# Altium project Slave_Project.PrjPcb
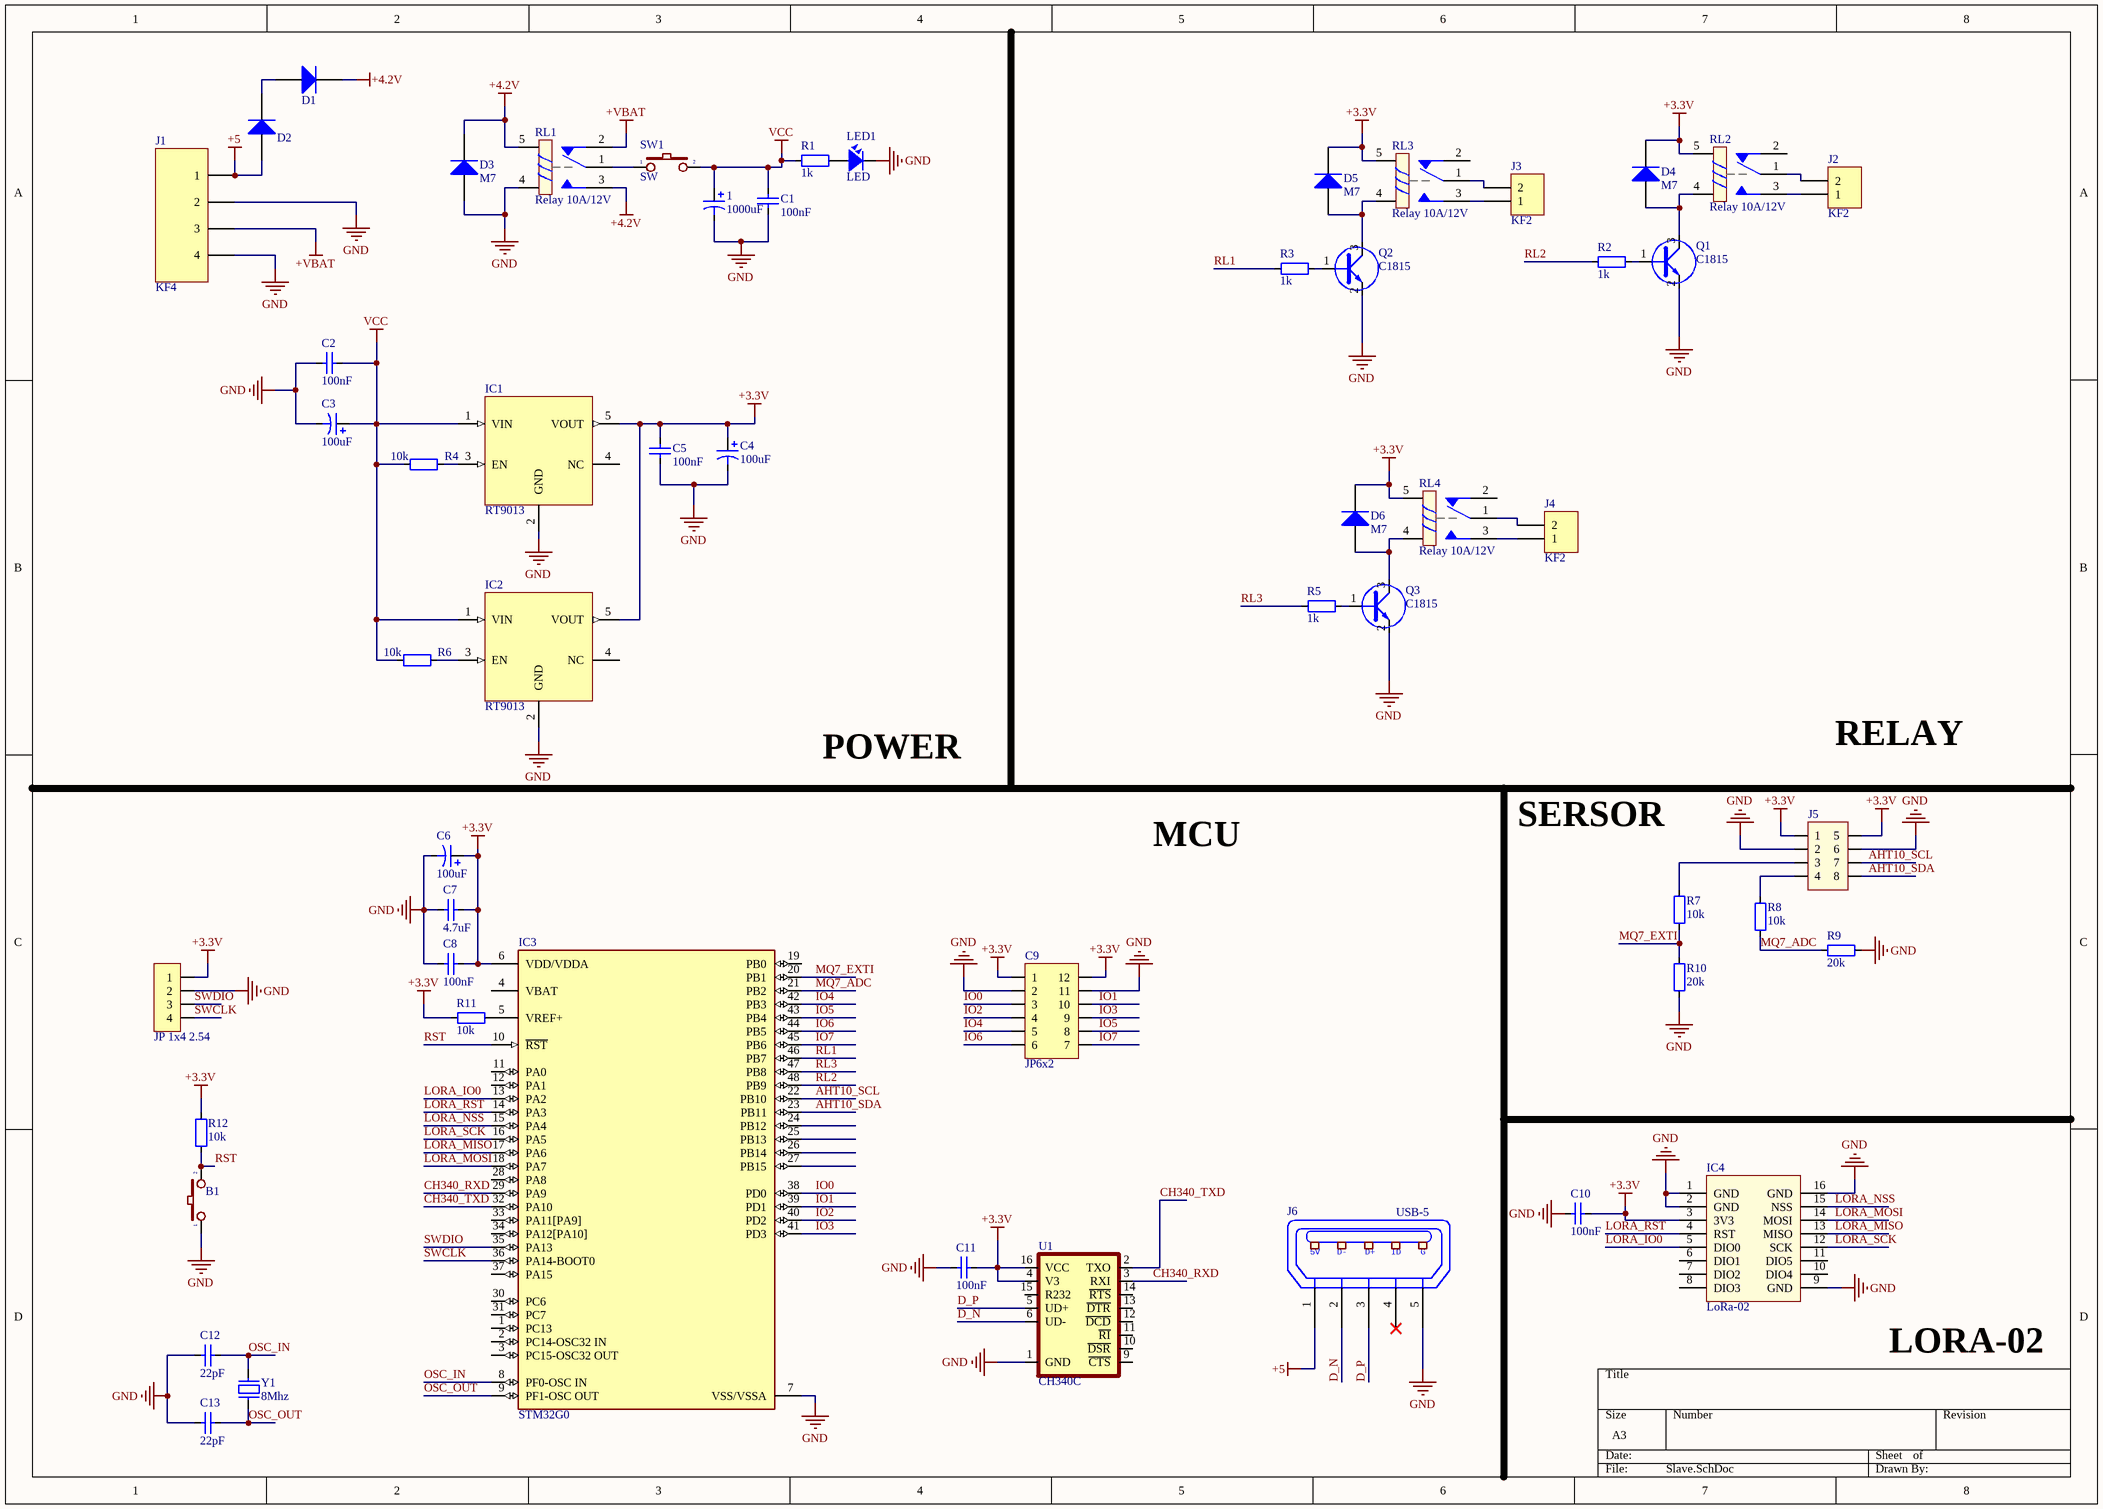
[diagram p0: Slave.SchDoc]
1 sheet, 55 parts. Net scope: global (net labels, ports and power ports of the same name join across sheets).
Board file: Slave.PcbDoc

## Sheet Slave.SchDoc
size A3; SheetNumber: 1; SheetTotal: 1

### Parts
1  1000uF  [C8mm]
B1  Button 3x4x2.5  [Button 3x4x2.5]  (value not drawn)
C1  100nF  [CAP_0805]
C2  100nF  [CAP_0805]
C3  100uF  [C5mm]
C4  100uF  [C5mm]
C5  100nF  [CAP_0805]
C6  100uF  [C5mm]
C7  4.7uF  [CAP_0805]
C8  100nF  [CAP_0805]
C9  JP6x2  [JP6-D2T]
C10  100nF  [CAP_0805]
C11  100nF  [CAP_0805]
C12  22pF  [CAP_0805]
C13  22pF  [CAP_0805]
D1  SS34 Diode 3A 40V  [DIODE SMA]  (value not drawn)
D2  SS34 Diode 3A 40V  [DIODE SMA]  (value not drawn)
D3  M7  [DIODE SMA]
D4  M7  [DIODE SMA]
D5  M7  [DIODE SMA]
D6  M7  [DIODE SMA]
IC1  RT9013  [SOT23-5]
IC2  RT9013  [SOT23-5]
IC3  STM32G0  [STM32G0]
IC4  LoRa-02  [LoRa-02]
J1  KF4  [KF4-5.08]
J2  KF2  [KF2-3.5]
J3  KF2  [KF2-3.5]
J4  KF2  [KF2-3.5]
J5  Connector 4x2  [JP4x2]  (value not drawn)
J6  USB-5  [USB-M1]
JP1  JP 1x4 2.54  [JP 1x4 DT]
LED1  LED  [LED-0805-Red]
Q1  C1815  [SOT23D]
Q2  C1815  [SOT23D]
Q3  C1815  [SOT23D]
R1  1k  [RES-SMD-0805]
R2  1k  [RES-SMD-0805]
R3  1k  [RES-SMD-0805]
R4  10k  [RES-SMD-0805]
R5  1k  [RES-SMD-0805]
R6  10k  [RES-SMD-0805]
R7  10k  [RES-SMD-0805]
R8  10k  [RES-SMD-0805]
R9  20k  [RES-SMD-0805]
R10  20k  [RES-SMD-0805]
R11  10k  [RES-SMD-0805]
R12  10k  [RES-SMD-0805]
RL1  Relay 10A/12V  [RELAY 5]
RL2  Relay 10A/12V  [RELAY 5]
RL3  Relay 10A/12V  [RELAY 5]
RL4  Relay 10A/12V  [RELAY 5]
SW1  SW  [SW2]
U1  CH340C  [SO016]
Y1  8Mhz  [Thach Anh 2 chan SMD5032]

### Nets
+3.3V: C4.1 C5.1 C6.1 C7.2 C8.1 C9.1 C9.12 C10.2 C11.2 D4.2(K) D5.2(K) D6.2(K) IC1.5(VOUT) IC2.5(VOUT) IC3.6(VDD/VDDA) IC4.3(3V3) J5.1 J5.5 JP1.1 R11.1 R12.1 RL2.5 RL3.5 RL4.5 U1.4(V3) U1.16(VCC)
+4.2V: D1.2(K) D3.2(K) RL1.3 RL1.5
+5: D2.1(A) J1.1 J6.1(P1)
+VBAT: J1.3 RL1.2
GND: 1.2 B1.1 C1.2 C2.2 C3.2 C4.2 C5.2 C6.2 C7.1 C8.2 C9.2 C9.11 C10.1 C11.1 C12.2 C13.2 D3.1(A) IC1.2(GND) IC2.2(GND) IC3.7(VSS/VSSA) IC4.1(GND) IC4.2(GND) IC4.9(GND) IC4.16(GND) J1.2 J1.4 J5.2 J5.6 J6.5(P5) JP1.2 LED1.2 Q1.2(E) Q2.2(E) Q3.2(E) R9.1 R10.1 RL1.4 U1.1(GND)
VCC: 1.1 C1.1 C2.1 C3.1 IC1.1(VIN) IC2.1(VIN) R1.2 R4.2 R6.2 SW1.2
AHT10_SCL: IC3.22(PB10) J5.7
AHT10_SDA: IC3.23(PB11) J5.8
CH340_RXD: IC3.29(PA9) U1.3(RXI)
CH340_TXD: IC3.32(PA10) U1.2(TXO)
D_N: J6.2(P2) U1.6(UD-)
D_P: J6.3(P3) U1.5(UD+)
IO0: C9.3 IC3.38(PD0)
IO1: C9.10 IC3.39(PD1)
IO2: C9.4 IC3.40(PD2)
IO3: C9.9 IC3.41(PD3)
IO4: C9.5 IC3.42(PB3)
IO5: C9.8 IC3.43(PB4)
IO6: C9.6 IC3.44(PB5)
IO7: C9.7 IC3.45(PB6)
LORA_IO0: IC3.13(PA2) IC4.5(DIO0)
LORA_MISO: IC3.17(PA6) IC4.13(MISO)
LORA_MOSI: IC3.18(PA7) IC4.14(MOSI)
LORA_NSS: IC3.15(PA4) IC4.15(NSS)
LORA_RST: IC3.14(PA3) IC4.4(RST)
LORA_SCK: IC3.16(PA5) IC4.12(SCK)
MQ7_ADC: IC3.21(PB2) R8.1 R9.2
MQ7_EXTI: IC3.20(PB1) R7.1 R10.2
OSC_IN: C12.1 IC3.8(PF0-OSC_IN) Y1.2
OSC_OUT: C13.1 IC3.9(PF1-OSC_OUT) Y1.1
RL1: IC3.46(PB7) R3.1
RL2: IC3.48(PB9) R2.1
RL3: IC3.47(PB8) R5.1
RST: B1.2 IC3.10(~{RST}) R12.2
SWCLK: IC3.36(PA14-BOOT0) JP1.4
SWDIO: IC3.35(PA13) JP1.3
NetD1_1: D1.1(A) D2.2(K)
NetD4_1: D4.1(A) Q1.3(C) RL2.4
NetD5_1: D5.1(A) Q2.3(C) RL3.4
NetD6_1: D6.1(A) Q3.3(C) RL4.4
NetIC1_3: IC1.3(EN) R4.1
NetIC2_3: IC2.3(EN) R6.1
NetIC3_5: IC3.5(VREF+) R11.2
NetJ2_1: J2.1 RL2.3
NetJ2_2: J2.2 RL2.1
NetJ3_1: J3.1 RL3.3
NetJ3_2: J3.2 RL3.1
NetJ4_1: J4.1 RL4.3
NetJ4_2: J4.2 RL4.1
NetJ5_3: J5.3 R7.2
NetJ5_4: J5.4 R8.2
NetLED1_1: LED1.1 R1.1
NetQ1_1: Q1.1(B) R2.2
NetQ2_1: Q2.1(B) R3.2
NetQ3_1: Q3.1(B) R5.2
NetRL1_1: RL1.1 SW1.1

Not connected (* = marked no-connect by the designer): IC1 4(NC); IC2 4(NC); IC3 1(PC13) 2(PC14-OSC32_IN) 3(PC15-OSC32_OUT) 4(VBAT) 11(PA0) 12(PA1) 19(PB0) 24(PB12) 25(PB13) 26(PB14) 27(PB15) 28(PA8) 30(PC6) 31(PC7) 33(PA11[PA9]) 34(PA12[PA10]) 37(PA15); IC4 6(DIO1) 7(DIO2) 8(DIO3) 10(DIO4) 11(DIO5); J6 4(P4)*; RL2 2; RL3 2; RL4 2; U1 9(~{CTS}) 10(~{DSR}) 11(~{RI}) 12(~{DCD}) 13(~{DTR}) 14(~{RTS}) 15(R232)

### Notes on the sheet
- POWER
- RELAY
- MCU
- SERSOR
- LORA-02
- (in symbol USB-5) 5V; D-; D+; ID; G

### Library data of the parts
1 = Cap Pol: 1000uF 16V 8x16mm; Published: 8-Jun-2000; LatestRevisionDate: 17-Jul-2002; LatestRevisionNote: Re-released for DXP Platform.; PackageReference: POLAR0.8; Publisher: Altium Limited
C1 C2 C5 C7 C8 C10-C13 = CapSMD: Capacitor; Value: 33p; Published: 8-Jun-2000; LatestRevisionDate: 17-Jul-2002; LatestRevisionNote: Re-released for DXP Platform.; PackageReference: RAD-0.3; Publisher: Altium Limited
C3 C4 C6 = Cap Pol: 100uF 16V; Published: 8-Jun-2000; LatestRevisionDate: 17-Jul-2002; LatestRevisionNote: Re-released for DXP Platform.; PackageReference: POLAR0.8; Publisher: Altium Limited
C9 = JP6x2: WR-PHD 2.54 mm Dual Socket Header; Manufacturer: W¨¹rth Elektronik eiSos GmbH; partNo: 61301221821; ComponentLink1 Description: Manufacturer; ComponentLink2 Description: Datasheet; NoPins: 12; Created Date: 29 March 2013; ComponentLink1URL: http://www.we-online.com; ComponentLink2URL: http://katalog.we-online.de/em/datasheet/6130xx21821.pdf; Created by: Karrer Zheng
D1-D6 = Diode M7 ( 4007 ): Dán; Don_Vi: Con; Ten_Linh_Kien: Diode M7 1N4007 SMD 1A 1000V; Ma_Hang: MH000944; Chung_Loai: Dán; Ghi_Chu: *
IC1 IC2 = RT9013: RT9013-33GB IC REG LINEAR 3.3V 500mA SOT23-5
J1 = KF4: Manufacturer: W¨¹rth Elektronik eiSos GmbH; PartNo: 691133710004; ComponentLink1 Description: Manufacturer; ComponentLink2 Description: Datasheet; NoPins: 4; ComponentLink1 URL: http://www.we-online.com; ComponentLink2 URL: http://katalog.we-online.de/em/datasheet/6911337100xx.pdf; Created By: Baojun Chen; Created Date: 4-Aug-15
J2-J4 = KF2: Manufacturer: Würth Elektronik eiSos GmbH; partNo: 691103110002; ComponentLink1 Description: Manufacturer; ComponentLink2 Description: Datasheet; NoPins: 2; Created Date: 29 October 2013; ComponentLink1URL: http://www.we-online.com; ComponentLink2URL: http://katalog.we-online.de/em/datasheet/6911031100xx.pdf; Created by: Karrer Zheng
J5 = JP4x2: Value: Connector 4x2
J6 = USB-5: Manufacturer: FCI; Manufacturer Part Number: 10118193-0001LF; Connector Type: USB - micro B; Number of Contacts: 5; Gender: Receptacle; Specifications: USB 2.0; .Creator: MM; .Checked PCB: RF; Supplier 1: Digi-Key; RoHS: RoHS Compliant; Category: Connectors, Interconnects; Stock 1: 28642; Pricing 1: 1=0.46, 10=0.433, 25=0.3712, 50=0.3156, 100=0.3032, 250=0.27224, 500=0.25988 (USD); Packaging: Cut Tape (CT); Mounting Type: Surface Mount, Right Angle, Horizontal; Features: Shielded, Solder Retention; Ingress Protection: -; ComponentLink1URL: http://portal.fciconnect.com/Comergent//fci/drawing/10118193.pdf; ComponentLink1Description: http://portal.fciconnect.com/Comergent//fci/drawing/10118193.pdf; Supplier Part Number 1: 609-4616-1-ND; .Checked SCH: MM
JP1 = JP 1x4 2.54 Duc Thang: Cắm; Ten_Linh_Kien: Jump Đơn Đực 2.54MM 1x40P Thẳng 11MM; Don_Vi: Con; Ma_Hang: MH000903; Ghi_Chu: *; Kieu_Chan: *; Chung_Loai: Cắm
LED1 = LED: LED Single colour Green and Red; Value: LED 3 ly Single Colour
Q1-Q3 = 2SC1815: NPN 600mW, ECB; Value: C1815
R1-R12 = Resistor - SMD: Resistor; Manufacturer: Generic Components; Class: Passive; Published: 08/06/2000; Publisher: Altium Hobart Technology Centre
RL1-RL4 = Relay 5: Relay SPDT,10A - 12VDC 5 Pin; Value: Relay SPDT, 10A, 12V
SW1 = SW2: Switch button 2 pin; Value: SW chip 2 pin
U1 = CH340C: USB to serial chip CH340; MF: WCH; Package: Package; Check_prices: https://www.snapeda.com/parts/CH340C/WCH/view-part/5428851/?ref=eda; Value: *; Price: None; MP: CH340C; Availability: Unavailable; SnapEDA_Link: https://www.snapeda.com/parts/CH340C/WCH/view-part/5428851/?ref=snap
Y1 = Thach Anh 2 chan SMD 5032: Crystal For all Crystal 2pin.; Value: 4Mhz